# EAGLE design untitledfix (EAGLE 7.5.0)
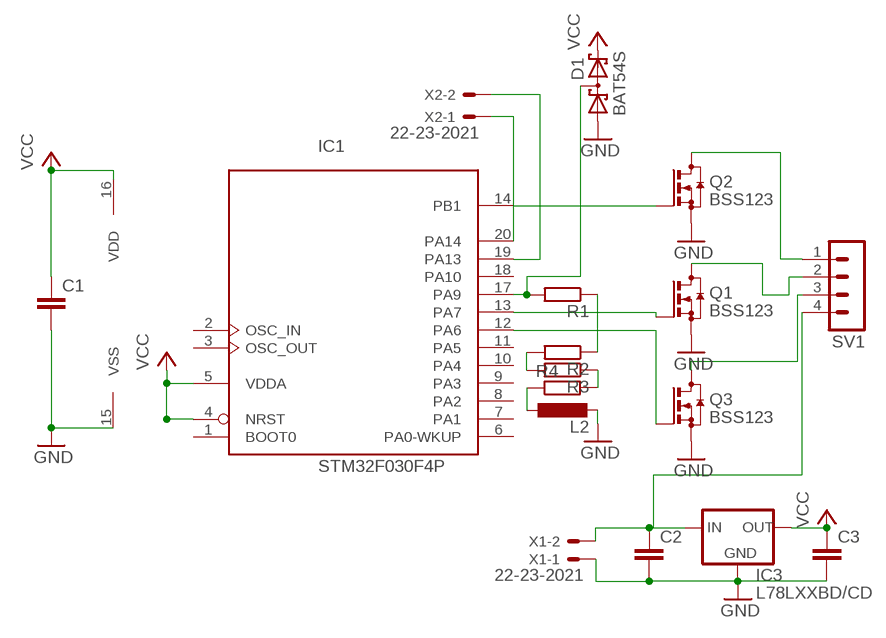
[diagram p0: schematic, sheet 1]

## Parts
C1  C-EUC0805K  [C0805K]
C2  C-EUC0805K  [C0805K]
C3  C-EUC0805K  [C0805K]
D1  BAT54S  [SOT23]
IC1  STM32F030F4P  [TSSOP20-I]
IC3  L78LXXBD/CD  [SO08]
L2  L-EU0207/5V  [0207/5V]
Q1  BSS123  [SOT23]
Q2  BSS123  [SOT23]
Q3  BSS123  [SOT23]
R1  R-EU_M0805  [M0805]
R2  R-EU_M0805  [M0805]
R3  R-EU_M0805  [M0805]
R4  R-EU_M0805  [M0805]
SV1  MA04-1  [MA04-1]
X1  22-23-2021  [22-23-2021]
X2  22-23-2021  [22-23-2021]

## Nets
GND: C1.2 C2.2 C3.2 D1.1(A1) IC1.15(VSS) IC3.2(GND1) IC3.3(GND3) IC3.6(GND4) IC3.7(GND2) L2.2 Q1.2(S) Q2.2(S) Q3.2(S) X1.1
N$1: D1.3(C1A2) IC1.17(PA9) R1.2
N$2: IC1.14(PB1) Q2.1(G)
N$3: IC1.13(PA7) Q1.1(G)
N$4: IC1.12(PA6) Q3.1(G)
N$5: C2.1 IC3.8(IN) SV1.4 X1.2
N$6: R1.1 R2.1
N$7: IC1.19(PA13) X2.2
N$8: Q3.3(D) SV1.3
N$9: Q1.3(D) SV1.2
N$10: Q2.3(D) SV1.1
N$11: IC1.20(PA14) X2.1
N$12: R2.2 R3.2
N$13: R3.1 R4.2
N$14: L2.1 R4.1
VCC: C1.1 C3.1 D1.2(C2) IC1.4(NRST) IC1.5(VDDA) IC1.16(VDD) IC3.1(OUT)
Unconnected: IC1.1(BOOT0) IC1.2(OSC_IN) IC1.3(OSC_OUT) IC1.6(PA0-WKUP) IC1.7(PA1) IC1.8(PA2) IC1.9(PA3) IC1.10(PA4) IC1.11(PA5) IC1.18(PA10)

## Library data of the parts
C1-C3 = rcl:C-EU: CAPACITOR, European symbol
D1 = diode:BAT54S: Schottky Diodes Pin connection corrected 2011-05-04 Source: Fairchild .. BAT54.pdf
IC1 = micro-stm_v3:STM32F030F*P: ARM 32-bit Cortex™-M0 CPU 48 MHz maximum frequency 16 Kbytes of Flash memory 4 kbytes of SRAM 15 GPIOs 2.4 to 3.6 V application supply
IC3 = v-reg-3:L78LXXBD/CD: VOLTAGE REGULATOR
L2 = rcl:L-EU: INDUCTOR, European symbol
Q1-Q3 = transistor-small-signal:BSS123: N-CHANNEL MOS FET
R1-R4 = rcl:R-EU_: RESISTOR, European symbol
SV1 = con-lstb:MA04-1: PIN HEADER; OC_FARNELL: unknown; OC_NEWARK: unknown
X1 X2 = con-molex:22-23-2021: .100" (2.54mm) Center Header - 2 Pin; MF: MOLEX; MPN: 22-23-2021; OC_FARNELL: 1462926; OC_NEWARK: 25C3832

## Board
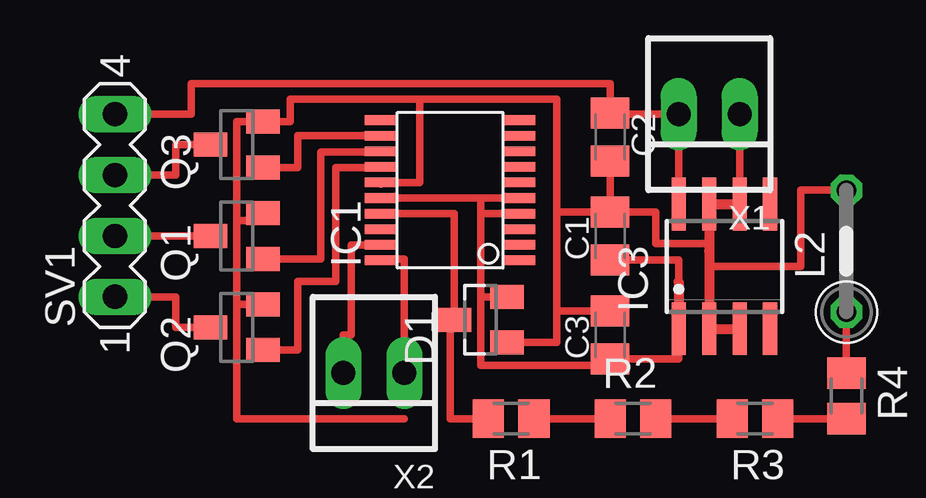
[diagram p1: board, top side]

No outline drawn. Coordinates in mm, seen from the top.
Copper layers (1*16): Top 0.25mm / dielectric 0.25mm / Bottom 0.25mm
Design rules "default *": minimum track width 0.25mm, minimum drill 0.25mm, track to track 0.25mm, track to pad 0.25mm, pad to pad 0.25mm, via to via 0.25mm, smd to smd 0.25mm, copper to edge 0.25mm, drill to drill 0.25mm, minimum pad ring 10mil, minimum via ring 8mil, stop-mask expansion 4mil, vias tented up to drill 0mil, thermal gap 10mil

### Footprints (pad centres in the part's own frame; a part is rotated, then mirrored left to right if it is on the bottom)
C0805K = smd 1.3 x 1.6: 1 -1,0; 2 1,0
SOT23 = smd 1 x 1.4: 1 -0.95,-1.1; 2 0.95,-1.1; 3 0,1.1
TSSOP20-I = smd 0.4 x 1.35: 1 -2.925,-2.875; 2 -2.275,-2.875; 3 -1.625,-2.875; 4 -0.975,-2.875; 5 -0.325,-2.875; 6 0.325,-2.875; 7 0.975,-2.875; 8 1.625,-2.875; 9 2.275,-2.875; 10 2.925,-2.875; 11 2.925,2.875; 12 2.275,2.875; 13 1.625,2.875; 14 0.975,2.875; 15 0.325,2.875; 16 -0.325,2.875; 17 -0.975,2.875; 18 -1.625,2.875; 19 -2.275,2.875; 20 -2.925,2.875
SO08 = smd 0.6 x 2.2: 1 -1.905,-2.6; 2 -0.635,-2.6; 3 0.635,-2.6; 4 1.905,-2.6; 5 1.905,2.6; 6 0.635,2.6; 7 -0.635,2.6; 8 -1.905,2.6
0207/5V = drill 0.813 octagon: 1 -2.54,0; 2 2.54,0
M0805 = smd 1.3 x 1.6: 1 -0.95,0; 2 0.95,0
MA04-1 = drill 1.016 long: 1 -3.81,0; 2 -1.27,0; 3 1.27,0; 4 3.81,0
22-23-2021 = drill 1 long: 1 -1.27,0; 2 1.27,0

### Placement (x,y rotation side)
C1  42.23,20.32 90 top
C2  42.23,24.45 270 top
C3  42.23,16.19 90 top
D1  36.83,16.83 90 top
IC1  35.56,22.23 90 top
IC3  46.99,19.05 0 top
L2  52.07,19.68 90 top
Q1  26.67,20.32 90 top
Q2  26.67,16.51 90 top
Q3  26.67,24.13 90 top
R1  38.1,12.7 180 top
R2  43.18,12.7 0 top
R3  48.26,12.7 180 top
R4  52.07,13.65 270 top
SV1  21.59,21.59 90 top
X1  46.35,25.4 180 top
X2  32.38,14.61 180 top

### Tracks (layer width: path | path; a pad name or v marks a point on that pad's centre or on a via)
GND
  Top 0.305: IC1.15 34.29,22.54 34.29,26.04 | 26.67,20.95 26.67,25.08 Q3.2 28.89,25.08 28.89,26.04 34.29,26.04 | 26.67,20.95 27.77,20.95 Q1.2 | Q2.2 26.67,17.46 | 26.67,17.46 26.67,20.95 | D1.1 40.01,15.88 40.01,17.19 | 34.29,26.04 40.01,26.04 40.01,21.32 | 40.01,21.32 40.01,17.19 | C1.2 40.01,21.32 | C1.2 44.13,21.32 44.13,20 46.35,20 | C3.2 40.01,17.19 | 46.35,19.68 46.35,19.05 50.16,19.05 50.16,22.23 L2.2 | C2.2 C1.2 | IC3.6 X1.1 | 26.67,17.46 26.67,12.7 33.66,12.7
  Top 0.406: IC3.3 IC3.2 46.35,19.68 46.35,20 IC3.7 IC3.6 | IC1.15
N$1
  Top 0.305: IC1.17 35.73,21.25 D1.3 | 35.73,17.46 D1.3 | D1.3 35.56,16.83 35.56,12.7 R1.2
N$2
  Top 0.305: IC1.14 32.69,23.18 30.8,23.18 30.8,18.41 29.21,18.41 29.21,15.56 Q2.1
N$3
  Top 0.305: Q1.1 30.16,19.37 30.16,23.81 32.69,23.81 IC1.13
N$4
  Top 0.305: IC1.12 29.21,24.5 29.21,23.18 Q3.1
N$5
  Top 0.305: IC3.8 X1.2 42.23,25.4 C2.1 42.23,26.67 24.77,26.67 24.77,25.4 SV1.4
N$6
  Top 0.305: R1.1 R2.1
N$7
  Top 0.305: IC1.19 31.43,19.95 31.43,16.19 31.11,16.19 X2.2
N$8
  Top 0.305: SV1.3 24.13,22.86 24.13,24.13 Q3.3
N$9
  Top 0.305: SV1.2 Q1.3
N$10
  Top 0.305: SV1.1 24.13,17.78 24.13,16.51 Q2.3
N$11
  Top 0.305: IC1.20 32.69,19.37 33.66,19.37 X2.1 33.66,16.51
N$12
  Top 0.305: R2.2 R3.2
N$13
  Top 0.305: R3.1 R4.2
N$14
  Top 0.305: L2.1 R4.1
VCC
  Top 0.305: 36.83,21.91 37.47,21.91 | 37.47,21.91 IC1.5 | IC1.16 36.83,21.9 | 36.83,21.9 37.47,21.9 37.47,21.91 | 36.83,17.78 36.83,20.95 36.83,21.25 | 36.83,21.25 36.83,21.9 | D1.2 36.83,17.78 | 36.83,17.78 36.83,14.92 42.55,14.92 C3.1 45.09,15.19 IC3.1 | C1.1 45.09,19.32 45.09,18.41 | IC1.4 36.83,21.25
  Top 0.406: 45.09,18.41 IC3.1 | IC1.5